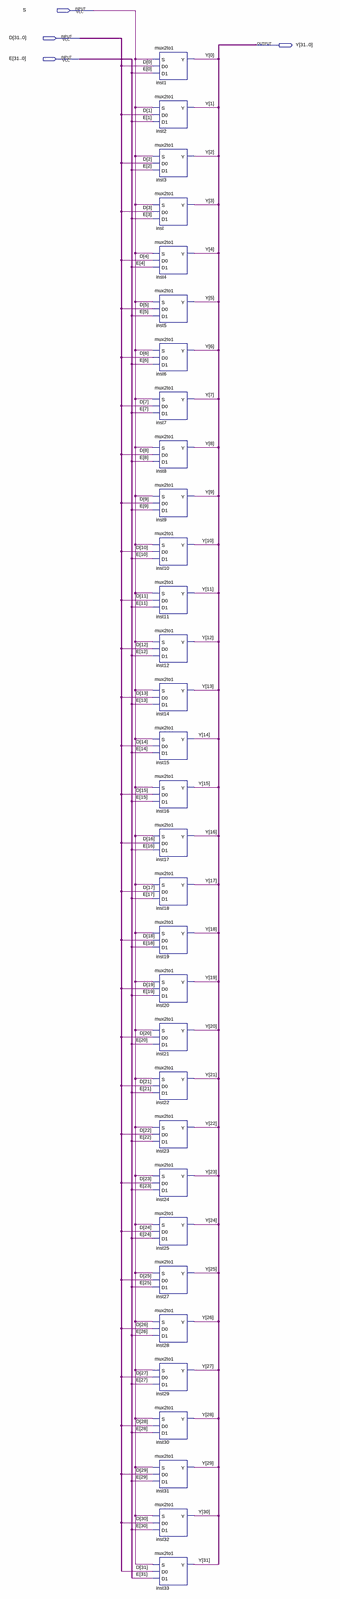
[diagram p0: schematic sheet, whole]
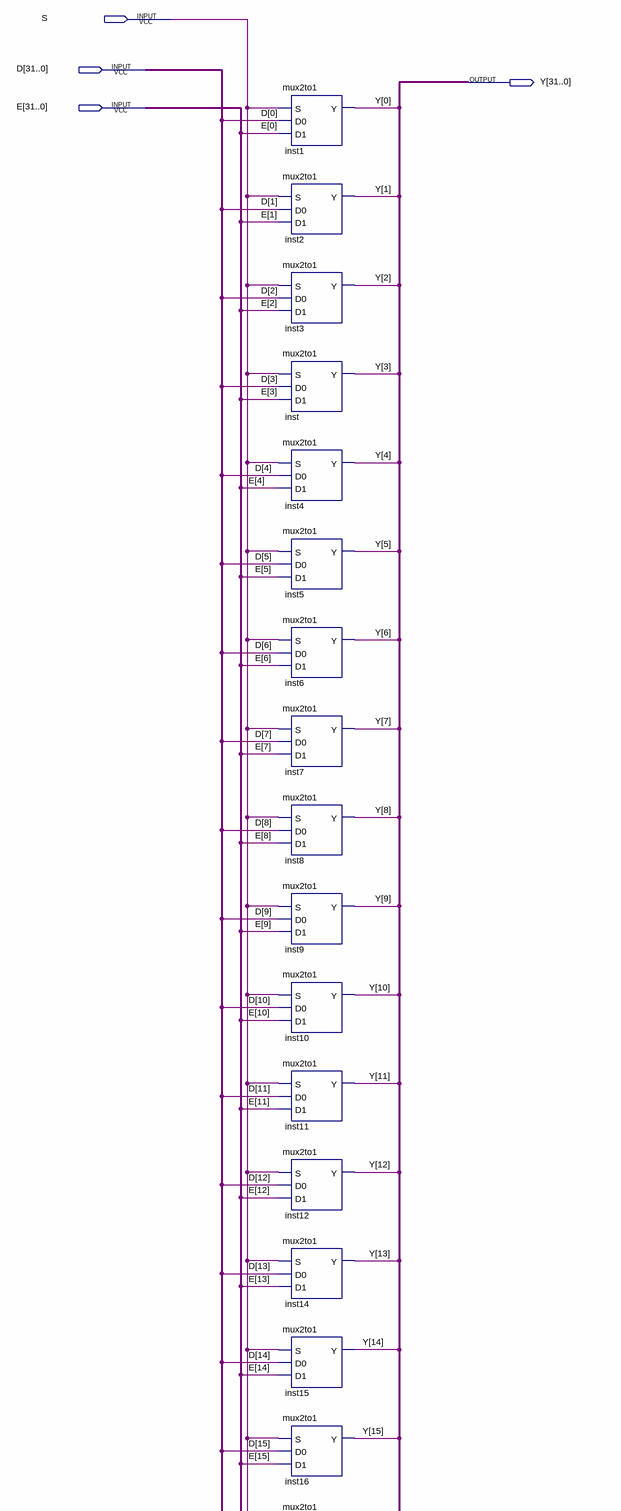
[diagram p1: schematic sheet, upper part]
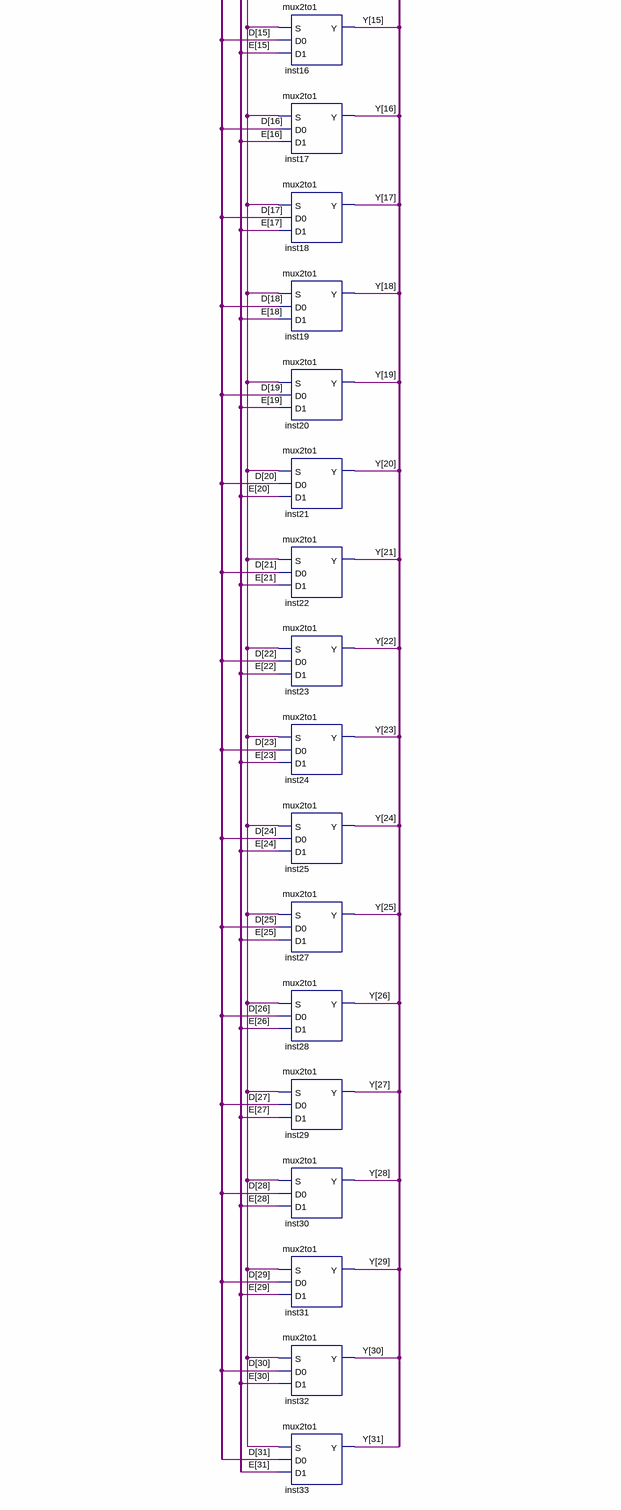
[diagram p2: schematic sheet, lower part]
// Quartus schematic mux2to1_32bits.bdf as structural Verilog: 32 symbols, 4 pins
module mux2to1_32bits (
  input  S,
  input  [31:0] D,
  input  [31:0] E,
  output [31:0] Y
);

  mux2to1 inst1 (.S(S), .D0(D[0]), .D1(E[0]), .Y(Y[0]));
  mux2to1 inst2 (.S(S), .D0(D[1]), .D1(E[1]), .Y(Y[1]));
  mux2to1 inst3 (.S(S), .D0(D[2]), .D1(E[2]), .Y(Y[2]));
  mux2to1 inst (.S(S), .D0(D[3]), .D1(E[3]), .Y(Y[3]));
  mux2to1 inst4 (.S(S), .D0(D[4]), .D1(E[4]), .Y(Y[4]));
  mux2to1 inst5 (.S(S), .D0(D[5]), .D1(E[5]), .Y(Y[5]));
  mux2to1 inst6 (.S(S), .D0(D[6]), .D1(E[6]), .Y(Y[6]));
  mux2to1 inst7 (.S(S), .D0(D[7]), .D1(E[7]), .Y(Y[7]));
  mux2to1 inst8 (.S(S), .D0(D[8]), .D1(E[8]), .Y(Y[8]));
  mux2to1 inst9 (.S(S), .D0(D[9]), .D1(E[9]), .Y(Y[9]));
  mux2to1 inst10 (.S(S), .D0(D[10]), .D1(E[10]), .Y(Y[10]));
  mux2to1 inst11 (.S(S), .D0(D[11]), .D1(E[11]), .Y(Y[11]));
  mux2to1 inst12 (.S(S), .D0(D[12]), .D1(E[12]), .Y(Y[12]));
  mux2to1 inst14 (.S(S), .D0(D[13]), .D1(E[13]), .Y(Y[13]));
  mux2to1 inst15 (.S(S), .D0(D[14]), .D1(E[14]), .Y(Y[14]));
  mux2to1 inst16 (.S(S), .D0(D[15]), .D1(E[15]), .Y(Y[15]));
  mux2to1 inst17 (.S(S), .D0(D[16]), .D1(E[16]), .Y(Y[16]));
  mux2to1 inst18 (.S(S), .D0(D[17]), .D1(E[17]), .Y(Y[17]));
  mux2to1 inst19 (.S(S), .D0(D[18]), .D1(E[18]), .Y(Y[18]));
  mux2to1 inst20 (.S(S), .D0(D[19]), .D1(E[19]), .Y(Y[19]));
  mux2to1 inst21 (.S(S), .D0(D[20]), .D1(E[20]), .Y(Y[20]));
  mux2to1 inst22 (.S(S), .D0(D[21]), .D1(E[21]), .Y(Y[21]));
  mux2to1 inst23 (.S(S), .D0(D[22]), .D1(E[22]), .Y(Y[22]));
  mux2to1 inst24 (.S(S), .D0(D[23]), .D1(E[23]), .Y(Y[23]));
  mux2to1 inst25 (.S(S), .D0(D[24]), .D1(E[24]), .Y(Y[24]));
  mux2to1 inst27 (.S(S), .D0(D[25]), .D1(E[25]), .Y(Y[25]));
  mux2to1 inst28 (.S(S), .D0(D[26]), .D1(E[26]), .Y(Y[26]));
  mux2to1 inst29 (.S(S), .D0(D[27]), .D1(E[27]), .Y(Y[27]));
  mux2to1 inst30 (.S(S), .D0(D[28]), .D1(E[28]), .Y(Y[28]));
  mux2to1 inst31 (.S(S), .D0(D[29]), .D1(E[29]), .Y(Y[29]));
  mux2to1 inst32 (.S(S), .D0(D[30]), .D1(E[30]), .Y(Y[30]));
  mux2to1 inst33 (.S(S), .D0(D[31]), .D1(E[31]), .Y(Y[31]));
endmodule
